# EAGLE design qPCR_pcb_breakout_MCP4551T-502E:MS (EAGLE 9.6.1)
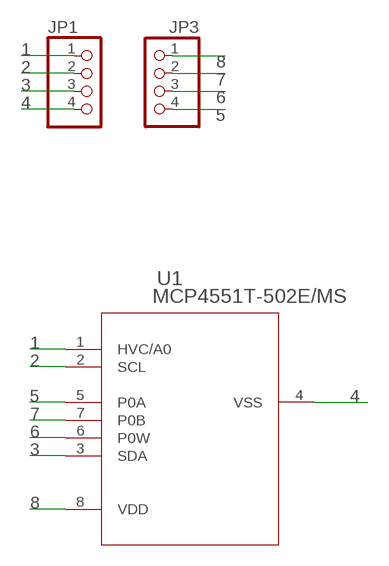
[diagram p0: schematic, sheet 1]

## Parts
JP1  PINHD-1X4  [1X04]
JP3  PINHD-1X4  [1X04]
U1  MCP4551T-502E/MS  [MSOP8_MC_MCH]

## Nets
1: JP1.1 U1.1(HVC/A0)
2: JP1.2 U1.2(SCL)
3: JP1.3 U1.3(SDA)
4: JP1.4 U1.4(VSS)
5: JP3.4 U1.5(P0A)
6: JP3.3 U1.6(P0W)
7: JP3.2 U1.7(P0B)
8: JP3.1 U1.8(VDD)

## Library data of the parts
JP1 JP3 = pinhead:PINHD-1X4: PIN HEADER
U1 = Ninja_qPCR:MCP4551T-502E/MS; BUILT_BY: EMA_UL_Team; MANUFACTURER_PART_NUMBER: MCP4551T-502E/MS; SOURCELIBRARY: Microchip_2014-06-20; VENDOR: Microchip

## Board
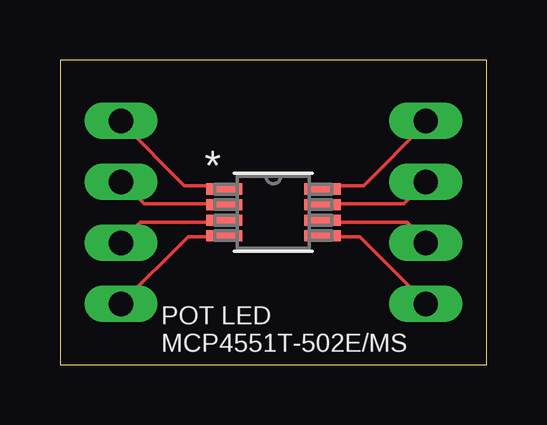
[diagram p1: board, top side]
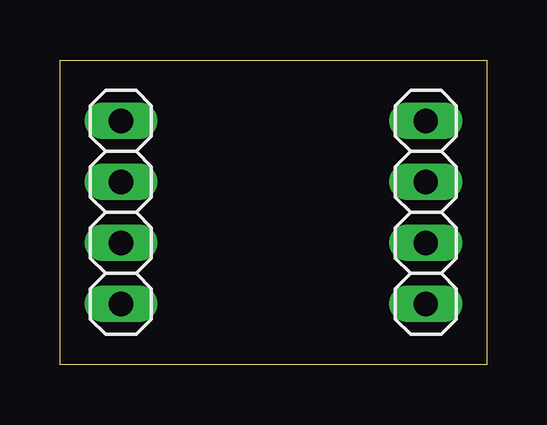
[diagram p2: board, bottom side, seen from below]

Size 17.78 x 12.7 mm. Coordinates in mm from the lower left corner, seen from the top.
Outline: 0,0 17.78,0 17.78,12.7 0,12.7 0,0
Copper layers (1*16): Top 0.035mm / dielectric 1.5mm / Bottom 0.035mm
Design rules "default": minimum track width 6mil, minimum drill 0.35mm, track to track 6mil, track to pad 6mil, pad to pad 6mil, via to via 6mil, smd to smd 6mil, copper to edge 40mil, drill to drill 6mil, minimum pad ring 10mil, minimum via ring 8mil, stop-mask expansion 4mil, vias tented up to drill 0mil, thermal gap 10mil

### Footprints (pad centres in the part's own frame; a part is rotated, then mirrored left to right if it is on the bottom)
1X04 = drill 1.016 long: 1 -3.81,0; 2 -1.27,0; 3 1.27,0; 4 3.81,0
MSOP8_MC_MCH = smd 1.513 x 0.466: 1 -2.044,0.975; 2 -2.044,0.325; 3 -2.044,-0.325; 4 -2.044,-0.975; 5 2.044,-0.975; 6 2.044,-0.325; 7 2.044,0.325; 8 2.044,0.975

### Placement (x,y rotation side)
JP1  2.54,6.35 270 bottom
JP3  15.24,6.35 270 bottom
U1  8.89,6.35 0 top

### Tracks (layer width: path | path; a pad name or v marks a point on that pad's centre or on a via)
1
  Top 0.152: U1.1 6.71,7.47 5.18,7.47 2.59,10.06 JP1.1
2
  Top 0.152: U1.2 6.71,6.71 3.5,6.71 2.59,7.62 JP1.2
3
  Top 0.152: U1.3 6.71,5.94 3.35,5.94 2.59,5.18 JP1.3
4
  Top 0.152: JP1.4 5.33,5.33 6.71,5.33 U1.4
5
  Top 0.152: U1.5 10.97,5.33 12.5,5.33 15.24,2.59 JP3.4
6
  Top 0.152: U1.6 10.97,5.94 14.48,5.94 15.24,5.18 JP3.3
7
  Top 0.152: JP3.2 14.33,6.71 10.97,6.71 U1.7
8
  Top 0.152: U1.8 10.97,7.47 12.65,7.47 15.24,10.06 JP3.1

### Text on the board
tPlace: POT LED / MCP4551T-502E/MS